# Altium schematic sheet FPGA_SLM.SchDoc: FPGA_SLM_V2
size A4; Date: 2019/08/25; CheckedBy: A Kadis; Author: DM Dong, YC Wang; CompanyName: CMMPE; DrawnBy: Daoming Dong, Youchao Wang; Revision: B; SheetNumber: 3; SheetTotal: 4
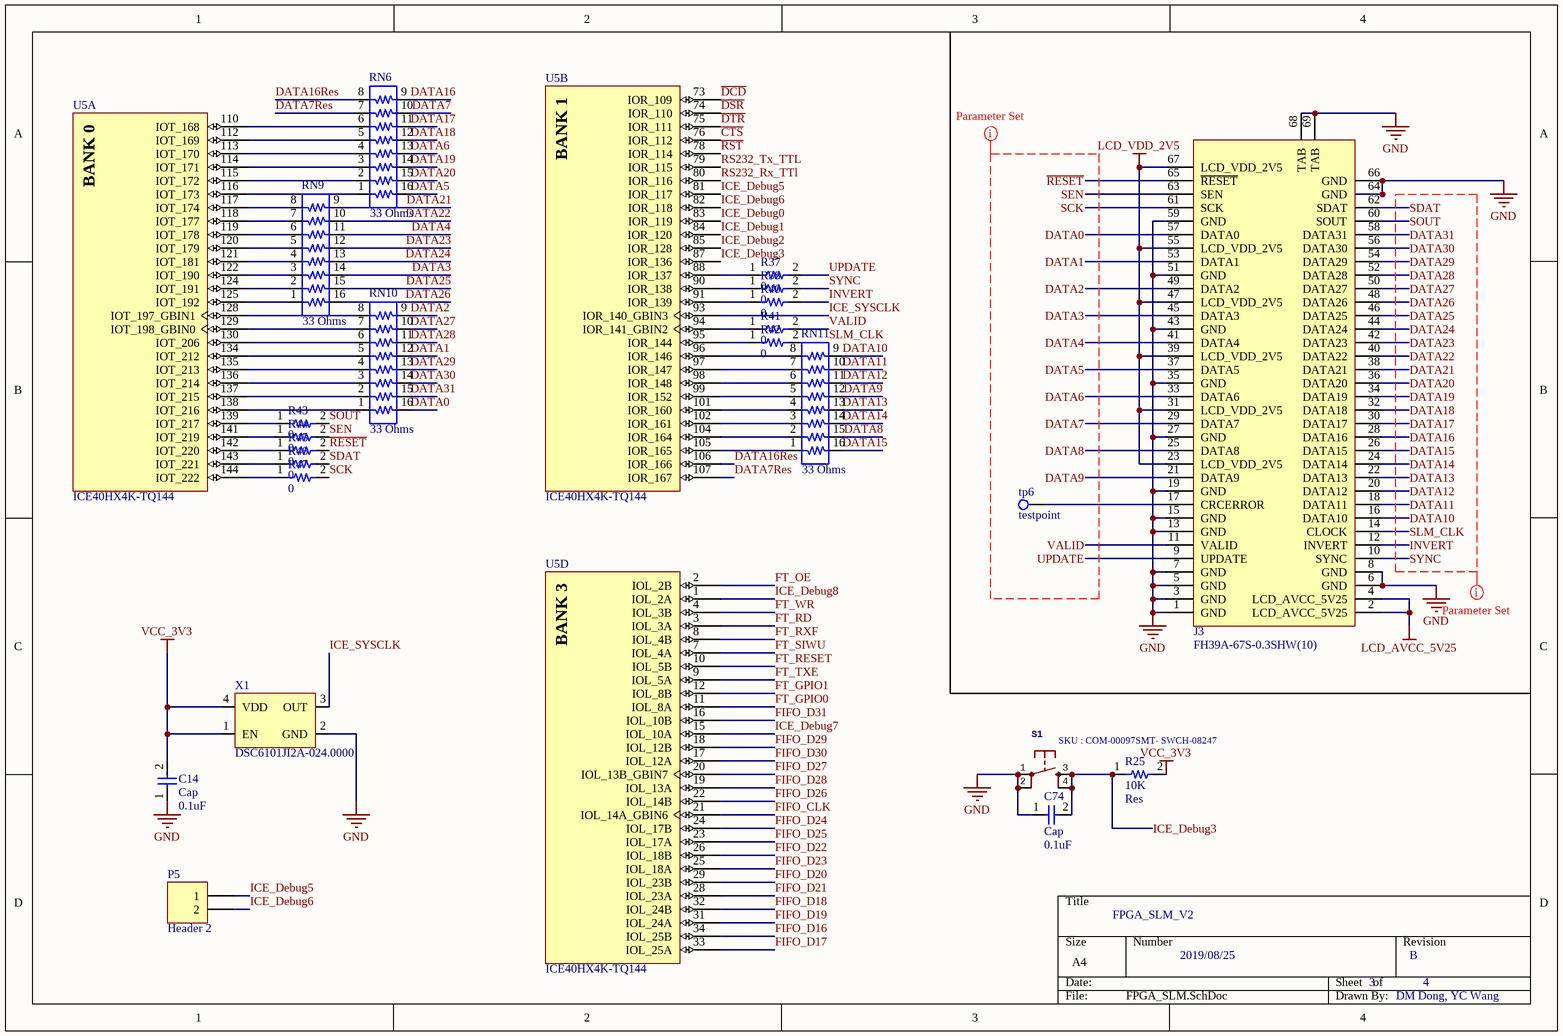
[diagram p0: FPGA_SLM.SchDoc]

## Parts
C14  value 0.1uF  Component Name: Cap  [Cap_0.1uF]  (hidden comment: AC0603KRX7R9BB104)
C74  value 0.1uF  Component Name: Cap  [Cap_0.1uF]  (hidden comment: AC0603KRX7R9BB104)
J3  FH39A-67S-0.3SHW(10)  [Hirose_connector]
P5  Header 2  [HDR1X2]
R25  value 10K  Component Name: Res  [RES_10K]  (hidden comment: RT0603WRE0710KL)
R37  value 0  [RES_0]  (hidden comment: CRCW06030000Z0EAC)
R38  value 0  [RES_0]  (hidden comment: CRCW06030000Z0EAC)
R40  value 0  [RES_0]  (hidden comment: CRCW06030000Z0EAC)
R41  value 0  [RES_0]  (hidden comment: CRCW06030000Z0EAC)
R42  value 0  [RES_0]  (hidden comment: CRCW06030000Z0EAC)
R43  value 0  [RES_0]  (hidden comment: CRCW06030000Z0EAC)
R44  value 0  [RES_0]  (hidden comment: CRCW06030000Z0EAC)
R45  value 0  [RES_0]  (hidden comment: CRCW06030000Z0EAC)
R46  value 0  [RES_0]  (hidden comment: CRCW06030000Z0EAC)
R47  value 0  [RES_0]  (hidden comment: CRCW06030000Z0EAC)
RN6  value 33 Ohms  [ResArray_0]  (hidden comment: EXB-2HV330JV)
RN9  value 33 Ohms  [ResArray_0]  (hidden comment: EXB-2HV330JV)
RN10  value 33 Ohms  [ResArray_0]  (hidden comment: EXB-2HV330JV)
RN11  value 33 Ohms  [ResArray_0]  (hidden comment: EXB-2HV330JV)
S1  SKU : COM-00097SMT- SWCH-08247  [TACTILE-PTH]
tp6  testpoint  [testpoint]
U5  ICE40HX4K-TQ144  [LATC-TQFP-144_L]  (parts A,B,D of 5)
X1  DSC6101JI2A-024.0000  [24MHzOscillator]

## Nets
GND: C14.1 C74.1 J3.1(GND) J3.3(GND) J3.5(GND) J3.6(GND) J3.7(GND) J3.8(GND) J3.13(GND) J3.15(GND) J3.19(GND) J3.27(GND) J3.35(GND) J3.43(GND) J3.51(GND) J3.59(GND) J3.64(GND) J3.66(GND) J3.68(TAB) J3.69(TAB) S1.1 S1.2 X1.2(GND)
LCD_AVCC_5V25: J3.2(LCD_AVCC_5V25) J3.4(LCD_AVCC_5V25)
LCD_VDD_2V5: J3.23(LCD_VDD_2V5) J3.31(LCD_VDD_2V5) J3.39(LCD_VDD_2V5) J3.47(LCD_VDD_2V5) J3.55(LCD_VDD_2V5) J3.67(LCD_VDD_2V5)
VCC_3V3: C14.2 R25.2 X1.1(EN) X1.4(VDD)
~{CTS}: U5.76(IOR_112)
~{DCD}: U5.73(IOR_109)
~{DSR}: U5.74(IOR_110)
~{DTR}: U5.75(IOR_111)
DATA0: J3.57(DATA0) RN10.16
DATA1: J3.53(DATA1) RN10.12
DATA2: J3.49(DATA2) RN10.9
DATA3: J3.45(DATA3) RN9.14
DATA4: J3.41(DATA4) RN9.11
DATA5: J3.37(DATA5) RN6.16
DATA6: J3.33(DATA6) RN6.13
DATA7: J3.29(DATA7) RN6.10
DATA7Res: RN6.7 U5.107(IOR_167)
DATA8: J3.25(DATA8) RN11.15
DATA9: J3.21(DATA9) RN11.12
DATA10: J3.16(DATA10) RN11.9
DATA11: J3.18(DATA11) RN11.10
DATA12: J3.20(DATA12) RN11.11
DATA13: J3.22(DATA13) RN11.13
DATA14: J3.24(DATA14) RN11.14
DATA15: J3.26(DATA15) RN11.16
DATA16: J3.28(DATA16) RN6.9
DATA16Res: RN6.8 U5.106(IOR_166)
DATA17: J3.30(DATA17) RN6.11
DATA18: J3.32(DATA18) RN6.12
DATA19: J3.34(DATA19) RN6.14
DATA20: J3.36(DATA20) RN6.15
DATA21: J3.38(DATA21) RN9.9
DATA22: J3.40(DATA22) RN9.10
DATA23: J3.42(DATA23) RN9.12
DATA24: J3.44(DATA24) RN9.13
DATA25: J3.46(DATA25) RN9.15
DATA26: J3.48(DATA26) RN9.16
DATA27: J3.50(DATA27) RN10.10
DATA28: J3.52(DATA28) RN10.11
DATA29: J3.54(DATA29) RN10.13
DATA30: J3.56(DATA30) RN10.14
DATA31: J3.58(DATA31) RN10.15
FIFO_CLK: U5.21(IOL_14A_GBIN6)
FIFO_D16: U5.34(IOL_25B)
FIFO_D17: U5.33(IOL_25A)
FIFO_D18: U5.32(IOL_24B)
FIFO_D19: U5.31(IOL_24A)
FIFO_D20: U5.29(IOL_23B)
FIFO_D21: U5.28(IOL_23A)
FIFO_D22: U5.26(IOL_18B)
FIFO_D23: U5.25(IOL_18A)
FIFO_D24: U5.24(IOL_17B)
FIFO_D25: U5.23(IOL_17A)
FIFO_D26: U5.22(IOL_14B)
FIFO_D27: U5.20(IOL_13B_GBIN7)
FIFO_D28: U5.19(IOL_13A)
FIFO_D29: U5.18(IOL_12B)
FIFO_D30: U5.17(IOL_12A)
FIFO_D31: U5.16(IOL_10B)
FT_GPIO0: U5.11(IOL_8A)
FT_GPIO1: U5.12(IOL_8B)
FT_OE: U5.2(IOL_2B)
FT_RD: U5.3(IOL_3A)
FT_RESET: U5.10(IOL_5B)
FT_RXF: U5.8(IOL_4B)
FT_SIWU: U5.7(IOL_4A)
FT_TXE: U5.9(IOL_5A)
FT_WR: U5.4(IOL_3B)
ICE_Debug0: U5.83(IOR_119)
ICE_Debug1: U5.84(IOR_120)
ICE_Debug2: U5.85(IOR_128)
ICE_Debug3: C74.2 R25.1 S1.3 S1.4 U5.87(IOR_136)
ICE_Debug5: P5.1 U5.81(IOR_117)
ICE_Debug6: P5.2 U5.82(IOR_118)
ICE_Debug7: U5.15(IOL_10A)
ICE_Debug8: U5.1(IOL_2A)
ICE_SYSCLK: U5.93(IOR_140_GBIN3) X1.3(OUT)
INVERT: J3.12(INVERT) R40.2
~{RESET}: J3.65(~{RESET}) R45.2
~{RST}: U5.78(IOR_114)
RS232_Rx_TTl: U5.80(IOR_116)
RS232_Tx_TTL: U5.79(IOR_115)
SCK: J3.61(SCK) R47.2
SDAT: J3.62(SDAT) R46.2
SEN: J3.63(SEN) R44.2
SLM_CLK: J3.14(CLOCK) R42.2
SOUT: J3.60(SOUT) R43.2
SYNC: J3.10(SYNC) R38.2
UPDATE: J3.9(UPDATE) R37.2
VALID: J3.11(VALID) R41.2
NetJ3_17: J3.17(CRCERROR) tp6.1
NetR37_1: R37.1 U5.88(IOR_137)
NetR38_1: R38.1 U5.90(IOR_138)
NetR40_1: R40.1 U5.91(IOR_139)
NetR41_1: R41.1 U5.94(IOR_141_GBIN2)
NetR42_1: R42.1 U5.95(IOR_144)
NetR43_1: R43.1 U5.139(IOT_217)
NetR44_1: R44.1 U5.141(IOT_219)
NetR45_1: R45.1 U5.142(IOT_220)
NetR46_1: R46.1 U5.143(IOT_221)
NetR47_1: R47.1 U5.144(IOT_222)
NetRN6_1: RN6.1 U5.116(IOT_173)
NetRN6_2: RN6.2 U5.115(IOT_172)
NetRN6_3: RN6.3 U5.114(IOT_171)
NetRN6_4: RN6.4 U5.113(IOT_170)
NetRN6_5: RN6.5 U5.112(IOT_169)
NetRN6_6: RN6.6 U5.110(IOT_168)
NetRN9_1: RN9.1 U5.125(IOT_192)
NetRN9_2: RN9.2 U5.124(IOT_191)
NetRN9_3: RN9.3 U5.122(IOT_190)
NetRN9_4: RN9.4 U5.121(IOT_181)
NetRN9_5: RN9.5 U5.120(IOT_179)
NetRN9_6: RN9.6 U5.119(IOT_178)
NetRN9_7: RN9.7 U5.118(IOT_177)
NetRN9_8: RN9.8 U5.117(IOT_174)
NetRN10_1: RN10.1 U5.138(IOT_216)
NetRN10_2: RN10.2 U5.137(IOT_215)
NetRN10_3: RN10.3 U5.136(IOT_214)
NetRN10_4: RN10.4 U5.135(IOT_213)
NetRN10_5: RN10.5 U5.134(IOT_212)
NetRN10_6: RN10.6 U5.130(IOT_206)
NetRN10_7: RN10.7 U5.129(IOT_198_GBIN0)
NetRN10_8: RN10.8 U5.128(IOT_197_GBIN1)
NetRN11_1: RN11.1 U5.105(IOR_165)
NetRN11_2: RN11.2 U5.104(IOR_164)
NetRN11_3: RN11.3 U5.102(IOR_161)
NetRN11_4: RN11.4 U5.101(IOR_160)
NetRN11_5: RN11.5 U5.99(IOR_152)
NetRN11_6: RN11.6 U5.98(IOR_148)
NetRN11_7: RN11.7 U5.97(IOR_147)
NetRN11_8: RN11.8 U5.96(IOR_146)

## Layout directives
rule Matched Net Lengths [Tolerance = 5mm]; net class SLM: DATA0, DATA1, DATA2, DATA3, DATA4, DATA5, DATA6, DATA7, DATA8, DATA9, DATA10, DATA11, DATA12, DATA13, DATA14, DATA15, DATA16, DATA17, DATA18, DATA19, DATA20, DATA21, DATA22, DATA23, DATA24, DATA25, DATA26, DATA27, DATA28, DATA29, DATA30, DATA31, INVERT, SCK, SDAT, SEN, SLM_CLK, SOUT, SYNC, UPDATE, VALID, ~{RESET}

## Notes on the sheet
- (in symbol ICE40HX4K-TQ144, part A) BANK 0
- (in symbol ICE40HX4K-TQ144, part B) BANK 1
- (in symbol ICE40HX4K-TQ144, part D) BANK 3

## Library data of the parts
C14 C74 = Cap_0.1uF: Multilayer Ceramic Capacitors MLCC - SMD/SMT 0.1uF 10% 50V AEC-Q200; Date Created: 01-Mar-2019; Created By: Daoming Dong; Datasheet URL: https://www.mouser.co.uk/datasheet/2/447/UPY-AC_NP0X7R_16V-to-630V_11-1511105.pdf; Package: 0603; Manufacture No.: AC0603KRX7R9BB104; Mouser No.: 603-AC0603KR9BB104
J3 = FH39A-67S-0.3SHW(10): FFC & FPC Connectors FPC ZIF CONN 67 POS SMT HORZ MNT; Manufacture: Hirose Connector; Component Name: Hirose Connector FH39A-67S-0.3SHW(10); Manufacture No.: FH39A-67S-0.3SHW(10); Mouser No.: 798-FH39A-67S-0.3SHW(10); Created By: Daoming Dong; Date Created: 05-Mar-2019; Datasheet URL.: https://www.mouser.co.uk/datasheet/2/185/_catalog-939287.pdf
P5 = Header 2: Header, 2-Pin; LatestRevisionDate: 17-Jul-2002; LatestRevisionNote: Re-released for DXP Platform.; Publisher: Altium Limited
R25 = Res_10K: Thin Film Resistors - SMD 10K ohm 0.05% 50 ppm High-Precision; Manufacture: Yageo; Manufacture No.: RT0603WRE0710KL; Mouser No.: 603-RT0603WRE0710KL; Created By: Daoming Dong; Date Created: 02-Mar-2019; Datasheet URL.: https://www.mouser.co.uk/datasheet/2/447/PYu-RT_1-to-0.01_RoHS_L_9-1222720.pdf; Case Code: 0603
R37 R38 R40-R47 = Res_0: Thick Film Resistors - SMD 1/10Watt 0ohms Commercial Use; Manufacture: Vishay; Component Name: Res; Case Code: 0603; Manufacture No.: CRCW06030000Z0EAC; Mouser No.: 71-CRCW06030000Z0EAC; Created By: Daoming Dong; Date Created: 02-Mar-2019; Datasheet URL.: https://www.mouser.co.uk/datasheet/2/427/crcwce3-1223726.pdf
RN6 RN9-RN11 = ResArray: Resistor Networks & Arrays 33 OHM 5%; Component Name: Resistor Array; Manufacture No.: EXB-2HV330JV; Mouser No.: 667-EXB-2HV330JV; Date Created: 11-Mar-2019; Datasheet URL.: https://www.mouser.co.uk/datasheet/2/315/AOC0000C14-1108062.pdf
S1 = TAC_SWITCHPTH: GateName_1: S; SymbolName_1: SWITCH-MOMENTARY; DeviceName: PTH; LibraryName: SparkFun-Electromechanical; DeviceSetName: TAC_SWITCH; Package: TACTILE-PTH
tp6 = Testpoint: Testpoint for testing voltage; Created By: Daoming Dong; Date Created: 11-Mar-2019
U5 = ICE40HX4K-TQ144: iCE40 HX4K Series FPGA Family, 3520 Logic Cells, 1.2 V Core, 80 K Embedded RAM Bits, 144-pin TQFP, Pb-Free, Tray; Manufacturer: Lattice Semiconductor; Embedded RAM Bits: 80K; Logic Cells: 3520; Phase-Locked Loops: 2; Supply Voltage: 1.2V; DatasheetVersion: Rev. 02.9; PackageVersion: Rev. 03.9, 02/2013; PackageReference: TQFP-144; PackageDescription: 144-Pin Thin Quad Flat Package, Body 20 x 20 mm, Pitch 0.5 mm; Supplier 1: Digi-Key; Supplier Part Number 1: 220-1572-ND; Supplier 2: Mouser; Supplier Part Number 2: 842-ICE40HX4K-TQ144; Packing: Tray; RoHS: TRUE; Mounting Technology: Surface Mount; PartNumber: ICE40HX4K-TQ144; ComponentLink1Description: Manufacturer URL; ComponentLink1URL: http://www.latticesemi.com/en; ComponentLink2Description: Datasheet; ComponentLink2URL: http://www.latticesemi.com/~/media/Documents/DataSheets/iCE/iCE40LPHXFamilyDataSheet.pdf; ComponentLink3Description: Package Specification; ComponentLink3URL: http://www.latticesemi.com/lit/docs/package/pkg.pdf
X1 = 24MHzOscillator: Standard Clock Oscillators MEMS Oscillator, Ultra Low Power, LVCMOS, -40C-85C, 25ppm, 2.5x2.0mm; Manufacture: Microchip; Frequency: 24 MHz; Created By: Daoming Dong; Date Created: 12-Mar-2019; Manufacture No.: DSC6101JI2A-024.0000; Mouser No.: 579-C6101JI2A0240000; Frequency Stability: 25 PPM; Datasheet URL.: https://www.mouser.co.uk/datasheet/2/268/20005624B-1149202.pdf